# EAGLE design Dual-Channel-OpAmp_V1 (EAGLE 6.4)
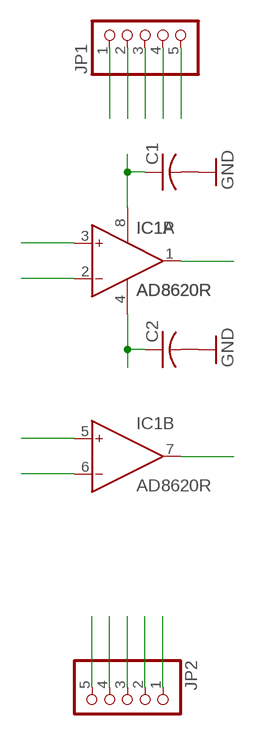
[diagram p0: schematic, sheet 1]

## Parts
C1  C-USC0805  [C0805]
C2  C-USC0805  [C0805]
IC1  AD8620R  [SO8]
JP1  PINHD-1X5  [1X05]
JP2  PINHD-1X5  [1X05]

## Nets
1: IC1.1(A:OUT) JP1.1
2: IC1.2(A:IN-) JP1.2
3: IC1.3(A:IN+) JP1.3
4: C2.1 IC1.4(P:V-) JP1.4
5: IC1.5(B:IN+) JP2.4
6: IC1.6(B:IN-) JP2.3
7: IC1.7(B:OUT) JP2.2
8: C1.1 IC1.8(P:V+) JP2.1
GND: C1.2 C2.2 JP1.5 JP2.5

## Library data of the parts
C1 C2 = rcl:C-US: CAPACITOR, American symbol
IC1 = analog-devices:AD8620: Precision, Very Low Noise, Low Input Bias Current, Wide Bandwidth JFET Operational Amplifiers Source: http://www.analog.com/static/imported-files/data_sheets/AD8610_8620.pdf; MF: ALTERA CORPORATION; MPN: AD8620ARZ; OC_FARNELL: 9994386; OC_NEWARK: 59K6972
JP1 JP2 = pinhead:PINHD-1X5: PIN HEADER

## Board
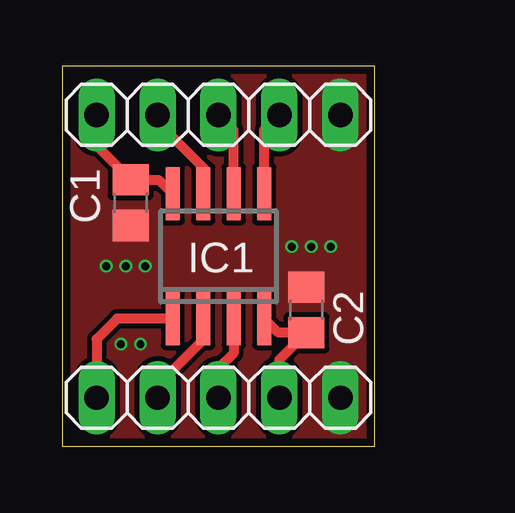
[diagram p1: board, top side]
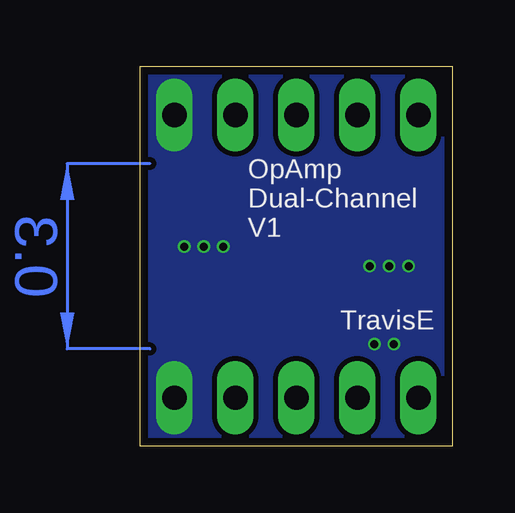
[diagram p2: board, bottom side, seen from below]

Size 13 x 15.85 mm. Coordinates in mm from the lower left corner, seen from the top.
Outline: 0,0 13,0 13,15.85 0,15.85 0,0
Copper layers (1*16): Top 0.035mm / dielectric 1.5mm / Bottom 0.035mm
Design rules "default *": minimum track width 10mil, minimum drill 24mil, track to track 8mil, track to pad 8mil, pad to pad 8mil, via to via 8mil, smd to smd 8mil, copper to edge 13mil, drill to drill 8mil, minimum pad ring 8mil, minimum via ring 4mil, stop-mask expansion 4mil, vias tented up to drill 14mil, thermal gap 10mil

### Footprints (pad centres in the part's own frame; a part is rotated, then mirrored left to right if it is on the bottom)
C0805 = smd 1.3 x 1.5: 1 -0.95,0; 2 0.95,0
SO8 = smd 0.6 x 2.2: 1 -1.905,-2.6; 2 -0.635,-2.6; 3 0.635,-2.6; 4 1.905,-2.6; 5 1.905,2.6; 6 0.635,2.6; 7 -0.635,2.6; 8 -1.905,2.6
1X05 = drill 1.016 long: 1 -5.08,0; 2 -2.54,0; 3 0,0; 4 2.54,0; 5 5.08,0

### Placement (x,y rotation side)
C1  2.84,10.16 270 top
C2  10.16,5.69 90 top
IC1  6.5,7.92 0 top
JP1  6.5,2.03 0 top
JP2  6.5,13.82 0 top

### Tracks (layer width: path | path; a pad name or v marks a point on that pad's centre or on a via)
1
  Top 0.406: IC1.1 2.28,5.32 1.42,4.47 JP1.1
2
  Top 0.406: IC1.2 5.87,4.45 4.06,2.64 4.06,2.13 JP1.2
3
  Top 0.406: IC1.3 7.14,3.89 6.5,3.25 JP1.3
4
  Top 0.406: IC1.4 8.99,4.74 C2.1 9.04,3.62 JP1.4
5
  Top 0.406: IC1.5 8.41,13.18 JP2.4
6
  Top 0.406: IC1.6 7.14,13.18 JP2.3
7
  Top 0.406: IC1.7 5.87,11.61 3.96,13.51 JP2.2
8
  Top 0.406: IC1.8 4.01,11.11 C1.1 1.42,12.53 JP2.1
GND  (via drill 0.33)
  other vias: 1.83,7.52 2.64,7.52 3.45,7.52 9.55,8.33 10.36,8.33 11.18,8.33 2.44,4.27 3.25,4.27
  pour Bottom (no thermals): 0.41,15.44 12.6,15.44 12.6,0.41 0.41,0.41
  pour Top (no thermals): 0.41,15.44 12.6,15.44 12.6,0.41 0.41,0.41
(copper drawn outside any net)
  shapes: Bottom area x1

### Text on the board
bPlace: OpAmp | Dual-Channel | V1 | TravisE